# EasyEDA Pro project ProPrj_odin-core_2026-06-12.epro

# Schematic Schematic1
Board Name: Board1; Create Date: 2026-05-22; Page Name: P1; Project Name: odin-core; Schematic Name: Schematic1; Update Date: 2026-05-23; Company: HeyCallMeK; Page Size: A4; Version: V1.0
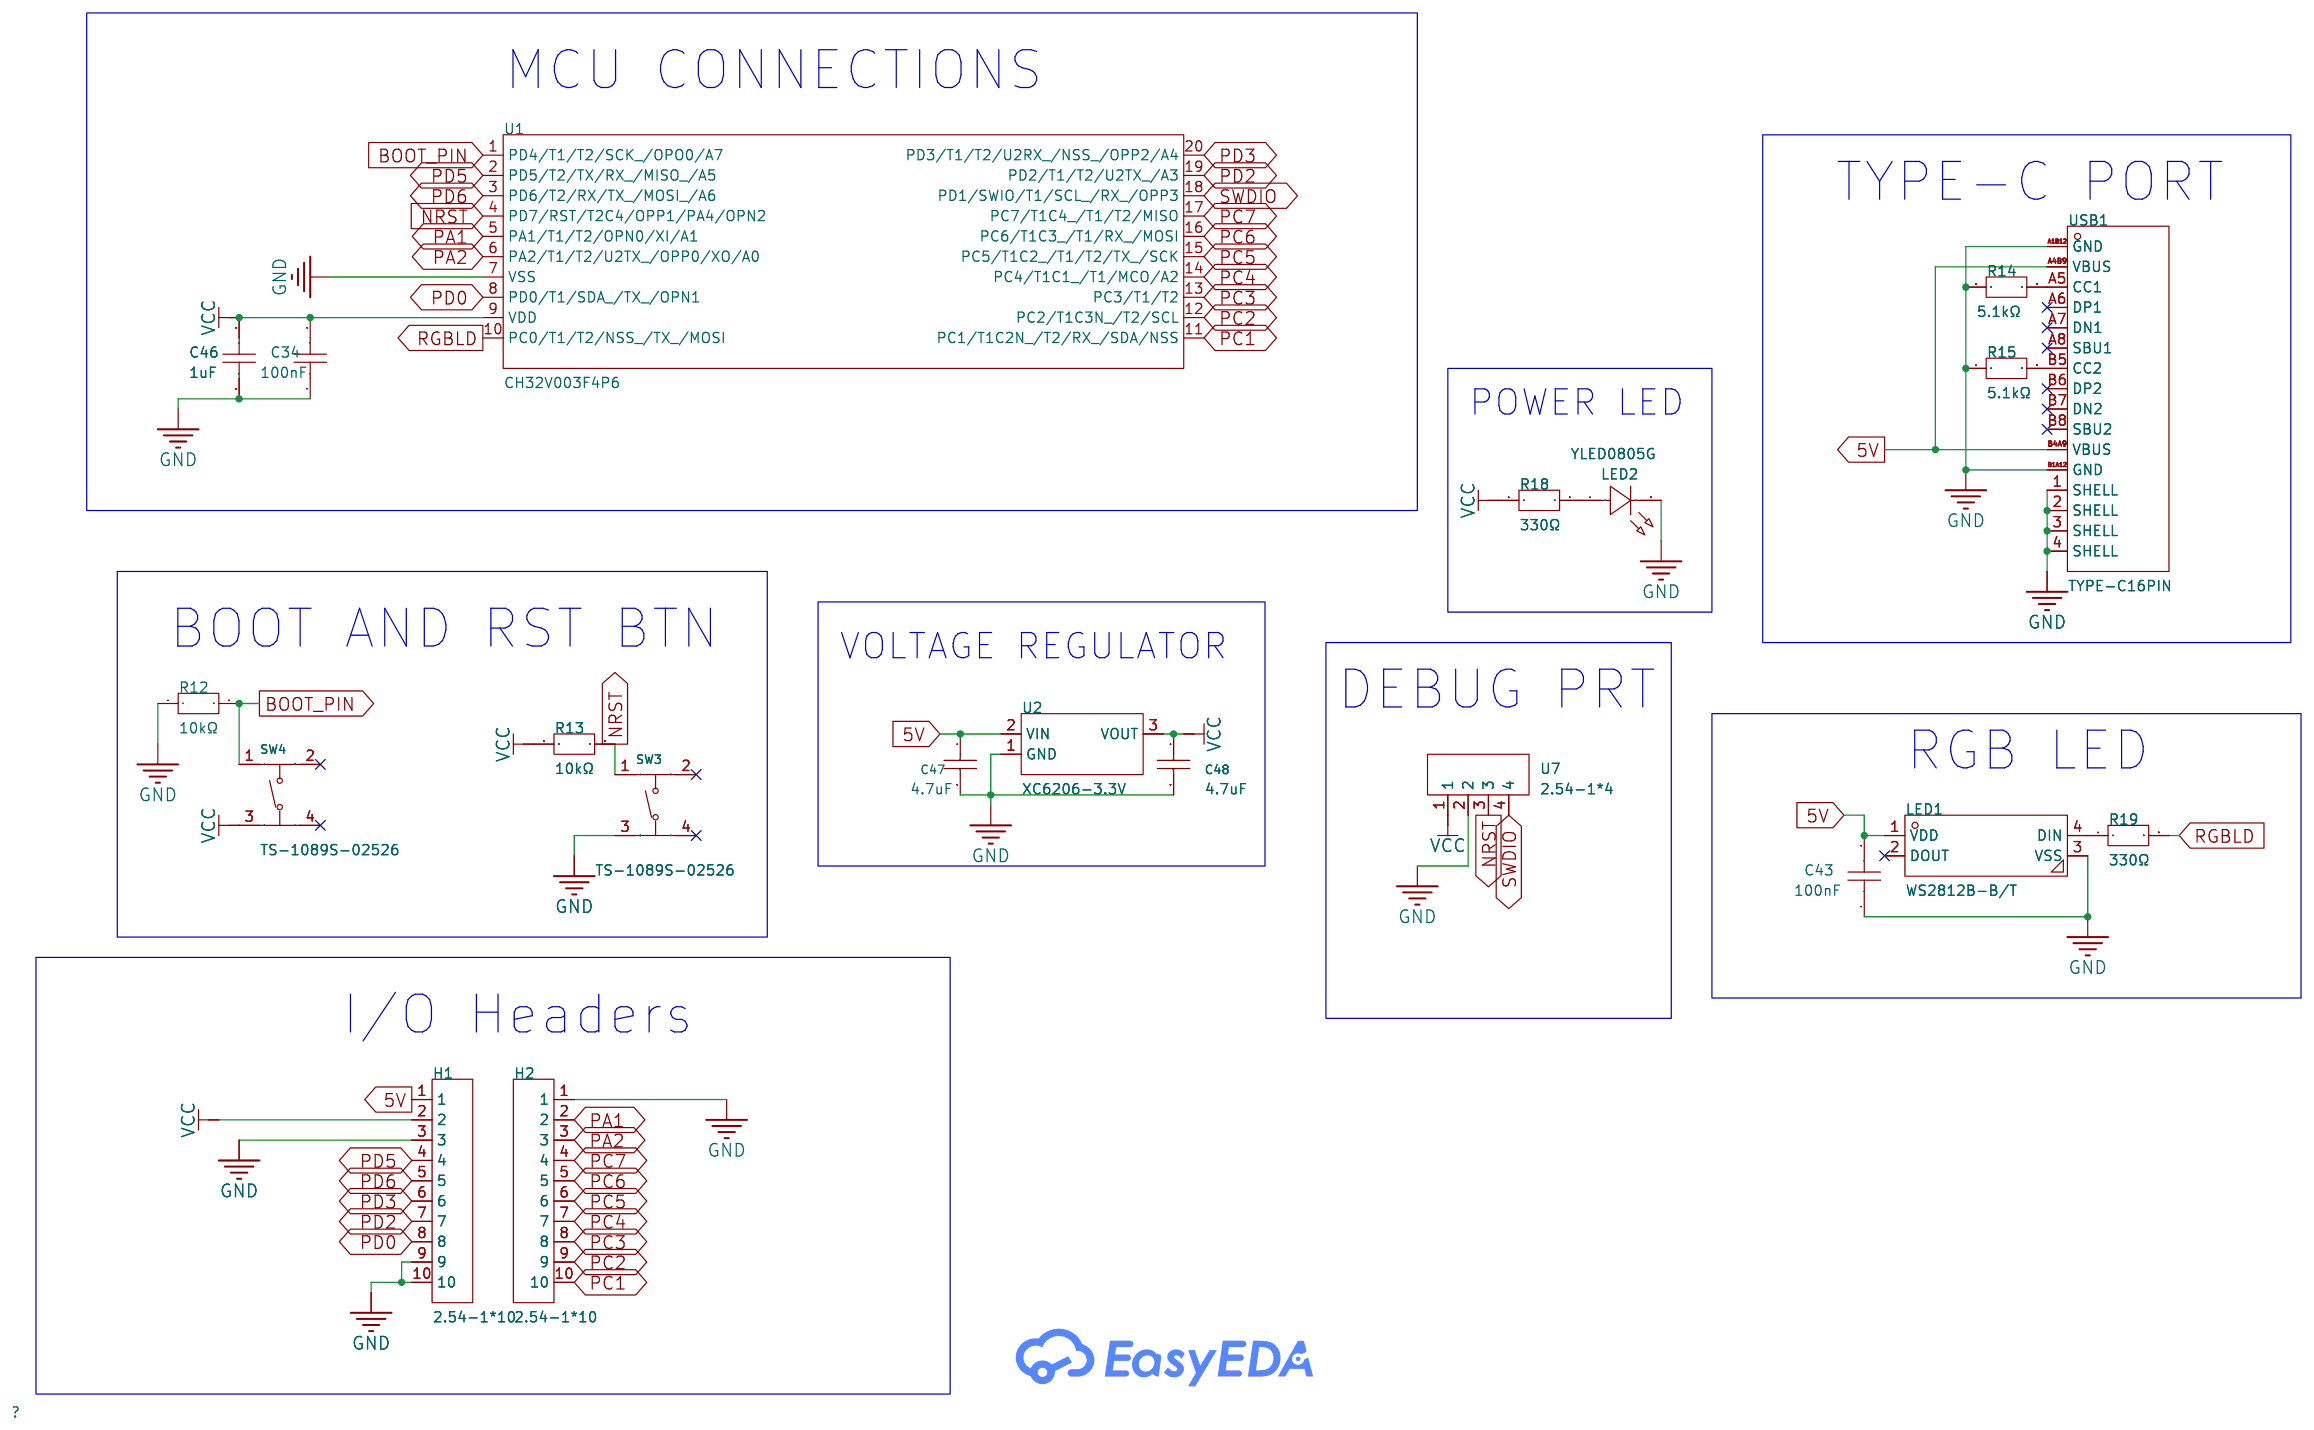
[diagram p0: schematic sheet]

## Parts
C34  100nF  [C0603]
C43  100nF  [C0603]
C46  1uF  [C0603]
C47  4.7uF  [C0603]
C48  4.7uF  [C0603]
H1  2.54-1*10  [HDR-TH_10P-P2.54-V-M]
H2  2.54-1*10  [HDR-TH_10P-P2.54-V-M]
LED1  WS2812B-B/T  [LED-SMD_4P-L5.0-W5.0-TL_WS2812B-B]
LED2  YLED0805G  [LED0805-FD-GREEN]
R12  10kΩ  [R0603]
R13  10kΩ  [R0603]
R14  5.1kΩ  [R0603]
R15  5.1kΩ  [R0603]
R18  330Ω  [R0603]
R19  330Ω  [R0603]
SW3  TS-1089S-02526  [SW-SMD_4P-L4.2-W3.3-P2.15-LS5.1]
SW4  TS-1089S-02526  [SW-SMD_4P-L4.2-W3.3-P2.15-LS5.1]
U1  CH32V003F4P6  [TSSOP-20_L6.5-W4.4-P0.65-LS6.4-BL]
U2  XC6206-3.3V  [SOT-89-3_L4.3-W2.3-P1.50-LS4.3-BR]
U7  2.54-1*4  [HDR-TH_4P-P2.54-V-M-1]
USB1  TYPE-C16PIN  [USB-C-SMD_TYPE-C16PIN]

## Library data of the parts
C34 C43 = FCC0603B104K500CT: Capacitance:100nF Tolerance:±10% Tolerance:±10% Voltage Rating:50V Temperature Coefficient:X7R; LCSC Part Name: 100nF ±10% 50V; Supplier Part: C5137636; Manufacturer: FOJAN(富捷); Supplier Footprint: 0603; JLCPCB Part Class: Extended Part; Datasheet: https://item.szlcsc.com/datasheet/FCC0603B104K500CT/5747088.html; Supplier: LCSC; Tolerance: ±10%; Voltage Rating: 50V; Temperature Coefficient: X7R
C46 = CGA0603X5R105K500JT: Capacitance:1uF Tolerance:±10% Tolerance:±10% Voltage Rating:50V Temperature Coefficient:X5R; LCSC Part Name: 1uF ±10% 50V; Supplier Part: C6119852; Manufacturer: HRE(芯声); Supplier Footprint: 0603; JLCPCB Part Class: Extended Part; Datasheet: https://item.szlcsc.com/datasheet/CGA0603X5R105K500JT/7062558.html; Supplier: LCSC; Tolerance: ±10%; Voltage Rating: 50V; Temperature Coefficient: X5R
C47 C48 = CL10A475KP8NNNC: Capacitance:4.7uF Tolerance:±10% Tolerance:±10% Voltage Rating:10V Temperature Coefficient:X5R; LCSC Part Name: 4.7uF ±10% 10V; Supplier Part: C1705; Manufacturer: SAMSUNG(三星); Supplier Footprint: 0603; JLCPCB Part Class: Extended Part; Datasheet: https://item.szlcsc.com/datasheet/CL10A475KP8NNNC/2057.html; Supplier: LCSC; Tolerance: ±10%; Voltage Rating: 10V; Temperature Coefficient: X5R
H1 H2 = 2.54-1*10: Pin Structure:1x10P Pitch:2.54mm Circluar Pins/Square Pins:Pin Header Mounting Type:Through Hole Number of Rows:1 Number of Pins:10P Current Rating:2.5A Length of Mating Pin:6mm Insulation Height:2.54mm Length of End Connection Pin:3mm Contact Material:Br; LCSC Part Name: 1x10P 间距:2.54mm 方针 直插; Supplier Part: C5156617; Manufacturer: ZHOURI(洲日); Supplier Footprint: 插件,P=2.54mm; JLCPCB Part Class: Extended Part; Datasheet: https://item.szlcsc.com/datasheet/2.54-1*10/5790717.html; Supplier: LCSC; Pin Structure: 1x10P; Pitch: 2.54mm; Circluar Pins/Square Pins: Pin Header; Mounting Type: Through Hole; Number of Rows: 1; Number of Pins: 10P; Current Rating: 2.5A; Length of Mating Pin: 6mm; Insulation Height: 2.54mm; Length of End Connection Pin: 3mm; Contact Material: Brass; Contact Plating: Gold; Operating Temperature: -40℃~+105℃
LED1 = WS2812B-B/T: Wavelength:520nm；471nm；621nm Luminous Intensity:R:300mcd~500mcd；B:200mcd~300mcd；G:600mcd~1000mcd Fixed-Frequency Pwm Mode:2kHz Data Transmission Rate:800Kbit/s Voltage - Supply:- Voltage - Supply:- Quiescent Current:0.6mA Lens Color:- Peak Wavelength:G:52; LCSC Part Name: RGB三色; Supplier Part: C2761795; Manufacturer: worldsemi; Supplier Footprint: SMD5050-4P; JLCPCB Part Class: Extended Part; Datasheet: https://item.szlcsc.com/datasheet/WS2812B-B%252FT/2886707.html; Supplier: LCSC; Wavelength: 520nm；471nm；621nm; Luminous Intensity: R:300mcd~500mcd；B:200mcd~300mcd；G:600mcd~1000mcd; Fixed-Frequency Pwm Mode: 2kHz; Data Transmission Rate: 800Kbit/s; Quiescent Current: 0.6mA; Peak Wavelength: G:520nm；R:621nm；B:471nm; Length: 5mm; Width: 1.57mm; Height: 5.4mm
LED2 = YLED0805G: Lamp Holder Type:2mm x 1.25mm square LED Illumination Color:Emerald Green Voltage - Forward(Vf):2.4V~3.1V Voltage - Forward(Vf):2.4V~3.1V Power(Watts):70mW Forward Current:20mA Wavelength - Dominant:516nm~534nm Wavelength - Dominant:516nm~534nm Peak Wavel; LCSC Part Name: 发光管; Supplier Part: C25170728; Manufacturer: YONGYUTAI(永裕泰); Supplier Footprint: 0805; JLCPCB Part Class: Extended Part; Datasheet: https://item.szlcsc.com/datasheet/YLED0805G/26899175.html; Supplier: LCSC; Lamp Holder Type: 2mm x 1.25mm square LED; Illumination Color: Emerald Green; Voltage - Forward(Vf): 2.4V~3.1V; Power(Watts): 70mW; Forward Current: 20mA; Wavelength - Dominant: 516nm~534nm; Peak Wavelength: 525nm; Diode Configuration: Discrete Diode; Lens Color: Water Clear; Luminous Intensity: 430mcd; Viewing Angle: 120°; Operating Temperature: -40℃~+85℃
R12 R13 = FRC0603J103 TS: Type:Thick Film Resistor Resistance:10kΩ Tolerance:±5% Tolerance:±5% Power(Watts):100mW Voltage-Supply(Max):75V Temperature Coefficient:±100ppm/℃ Temperature Coefficient:±100ppm/℃ Operating Temperature:-55℃~+155℃ Operating Temperature:-55℃~+155℃; LCSC Part Name: 10kΩ ±5% 100mW 厚膜电阻; Supplier Part: C2930027; Manufacturer: FOJAN(富捷); Supplier Footprint: 0603; JLCPCB Part Class: Extended Part; Datasheet: https://item.szlcsc.com/datasheet/FRC0603J103%2520TS/3266960.html; Supplier: LCSC; Type: Thick Film Resistor; Tolerance: ±5%; Power(Watts): 100mW; Voltage-Supply(Max): 75V; Temperature Coefficient: ±100ppm/℃; Operating Temperature: -55℃~+155℃
R14 R15 = FRC0603F5101TS: Type:Thick Film Resistor Resistance:5.1kΩ Tolerance:±1% Tolerance:±1% Power(Watts):100mW Voltage-Supply(Max):75V Temperature Coefficient:±100ppm/℃ Temperature Coefficient:±100ppm/℃ Operating Temperature:-55℃~+155℃ Operating Temperature:-55℃~+155℃; LCSC Part Name: 5.1kΩ ±1% 100mW 厚膜电阻; Supplier Part: C2907044; Manufacturer: FOJAN(富捷); Supplier Footprint: 0603; JLCPCB Part Class: Extended Part; Supplier: LCSC; Type: Thick Film Resistor; Tolerance: ±1%; Power(Watts): 100mW; Voltage-Supply(Max): 75V; Temperature Coefficient: ±100ppm/℃; Operating Temperature: -55℃~+155℃
R18 R19 = FRC0603J331 TS: Type:Thick Film Resistor Resistance:330Ω Tolerance:±5% Tolerance:±5% Power(Watts):100mW Voltage-Supply(Max):75V Temperature Coefficient:±100ppm/℃ Temperature Coefficient:±100ppm/℃ Operating Temperature:-55℃~+155℃ Operating Temperature:-55℃~+155℃; LCSC Part Name: 330Ω ±5% 100mW 厚膜电阻; Supplier Part: C2907152; Manufacturer: FOJAN(富捷); Supplier Footprint: 0603; JLCPCB Part Class: Extended Part; Supplier: LCSC; Type: Thick Film Resistor; Tolerance: ±5%; Power(Watts): 100mW; Voltage-Supply(Max): 75V; Temperature Coefficient: ±100ppm/℃; Operating Temperature: -55℃~+155℃
SW3 SW4 = TS-1089S-02526: Circuit:SPST Actuator Style:Oval button Mounting Style:Brick nogging Switch Length:4.2mm Switch Width:3.25mm Switch Height:2.5mm Contact Current:50mA Voltage Rating (DC):12V With Lamp:- Mechanical Life:-; LCSC Part Name: 4.2*3.25*2.5mm 立贴 轻触开关; Supplier Part: C455282; Manufacturer: XUNPU(讯普); Supplier Footprint: SMD,3.3x4.2mm; JLCPCB Part Class: Extended Part; Datasheet: https://atta.szlcsc.com/upload/public/pdf/source/20191118/C455282_2E86A26A9CC4FEF4662951C4D45ED672.pdf; Supplier: LCSC; Circuit: SPST; Actuator Style: Oval button; Mounting Style: Brick nogging; Switch Length: 4.2mm; Switch Width: 3.25mm; Switch Height: 2.5mm; Contact Current: 50mA; Voltage Rating (DC): 12V
U1 = CH32V006F8P6_C52753342: LCSC Part Name: CH32V006F8P6; Supplier Part: C52753342; Manufacturer: WCH(南京沁恒); Supplier Footprint: TSSOP-20; JLCPCB Part Class: Extended Part; Datasheet: https://item.szlcsc.com/datasheet/CH32V006F8P6/55654148.html; Supplier: LCSC
U2 = XC6206-3.3V_C7603199: Features:Short Circuit Protection；Over Current Protection; LCSC Part Name: 低功耗LDO，采用CMOS和激光微调技术，兼容低ESR陶瓷电容; Supplier Part: C7603199; Manufacturer: YONGYUTAI(永裕泰); Supplier Footprint: SOT-89; JLCPCB Part Class: Extended Part; Datasheet: https://item.szlcsc.com/datasheet/XC6206-3.3V/8728693.html; Supplier: LCSC; Features: Short Circuit Protection；Over Current Protection
U7 = 2.54-1*4: Pin Structure:1x4P Pitch:2.54mm Circluar Pins/Square Pins:Pin Header Mounting Type:Through Hole Number of Rows:1 Number of Pins:4P Current Rating:2.5A Length of Mating Pin:6mm Insulation Height:2.54mm Length of End Connection Pin:3mm Contact Material:Bras; LCSC Part Name: 1x4P 间距:2.54mm 方针 直插; Supplier Part: C5116483; Manufacturer: ZHOURI(洲日); Supplier Footprint: 插件,P=2.54mm; JLCPCB Part Class: Extended Part; Datasheet: https://item.szlcsc.com/datasheet/2.54-1*4/5692726.html; Supplier: LCSC; Pin Structure: 1x4P; Pitch: 2.54mm; Circluar Pins/Square Pins: Pin Header; Mounting Type: Through Hole; Number of Rows: 1; Number of Pins: 4P; Current Rating: 2.5A; Length of Mating Pin: 6mm; Insulation Height: 2.54mm; Length of End Connection Pin: 3mm; Contact Material: Brass; Contact Plating: Gold; Operating Temperature: -40℃~+105℃
USB1 = TYPE-C16PIN: Connector Type:Type-C Protocol Standard:- Gender:Female Mounting Type:Surface Mount, Right Angle Number of Contacts:16P Number of Ports:1 Current Rating-Power:3A Voltage Rating:30V Connect-Disconnect Life:10,000 Cycles Supplementary Features:- Center Heig; LCSC Part Name: 16P卧贴母座; Supplier Part: C393939; Manufacturer: SHOU HAN(首韩); Supplier Footprint: SMD; JLCPCB Part Class: Extended Part; Datasheet: https://item.szlcsc.com/datasheet/TYPE-C16PIN/372551.html; Supplier: LCSC; Connector Type: Type-C; Gender: Female; Mounting Type: Surface Mount, Right Angle; Number of Contacts: 16P; Number of Ports: 1; Current Rating-Power: 3A; Voltage Rating: 30V; Connect-Disconnect Life: 10,000 Cycles; Detection color: Black; Operating Temperature: -40℃~+85℃

## Nets
5V: C43.2 C47.1 H1.1 LED1.1(VDD) U2.2(VIN) USB1.A4B9(VBUS) USB1.B4A9(VBUS)
GND: C34.1 C43.1 C46.2 C47.2 C48.2 H1.3 H1.9 H1.10 H2.1 LED1.3(VSS) LED2.2(K) R12.1 R14.1 R15.1 SW3.3 U1.7(VSS) U2.1(GND) U7.2 USB1.1(SHELL) USB1.2(SHELL) USB1.3(SHELL) USB1.4(SHELL) USB1.A1B12(GND) USB1.B1A12(GND)
VCC: C34.2 C46.1 C48.1 H1.2 R13.1 R18.1 SW4.3 U1.9(VDD) U2.3(VOUT) U7.1
BOOT_PIN: R12.2 SW4.1 U1.1(PD4/T1/T2/SCK_/OPO0/A7)
NRST: R13.2 SW3.1 U1.4(PD7/RST/T2C4/OPP1/PA4/OPN2) U7.3
PA1: H2.2 U1.5(PA1/T1/T2/OPN0/XI/A1)
PA2: H2.3 U1.6(PA2/T1/T2/U2TX_/OPP0/XO/A0)
PC1: H2.10 U1.11(PC1/T1C2N_/T2/RX_/SDA/NSS)
PC2: H2.9 U1.12(PC2/T1C3N_/T2/SCL)
PC3: H2.8 U1.13(PC3/T1/T2)
PC4: H2.7 U1.14(PC4/T1C1_/T1/MCO/A2)
PC5: H2.6 U1.15(PC5/T1C2_/T1/T2/TX_/SCK)
PC6: H2.5 U1.16(PC6/T1C3_/T1/RX_/MOSI)
PC7: H2.4 U1.17(PC7/T1C4_/T1/T2/MISO)
PD0: H1.8 U1.8(PD0/T1/SDA_/TX_/OPN1)
PD2: H1.7 U1.19(PD2/T1/T2/U2TX_/A3)
PD3: H1.6 U1.20(PD3/T1/T2/U2RX_/NSS_/OPP2/A4)
PD5: H1.4 U1.2(PD5/T2/TX/RX_/MISO_/A5)
PD6: H1.5 U1.3(PD6/T2/RX/TX_/MOSI_/A6)
RGBLD: R19.2 U1.10(PC0/T1/T2/NSS_/TX_/MOSI)
SWDIO: U1.18(PD1/SWIO/T1/SCL_/RX_/OPP3) U7.4
$1N971: R14.2 USB1.A5(CC1)
$1N974: R15.2 USB1.B5(CC2)
$1N1298: LED2.1(A) R18.2
$1N1874: LED1.4(DIN) R19.1

Not connected (* = marked no-connect by the designer): LED1 2(DOUT)*; SW3 2* 4*; SW4 2* 4*; USB1 A6(DP1)* A7(DN1)* A8(SBU1)* B6(DP2)* B7(DN2)* B8(SBU2)*

## Notes on the sheet
- MCU CONNECTIONS
- TYPE-C PORT
- POWER LED
- BOOT AND RST BTN
- VOLTAGE REGULATOR
- DEBUG PRT
- RGB LED
- I/O Headers
